# Altium schematic sheet Cabinet_Device.SchDoc
size A4
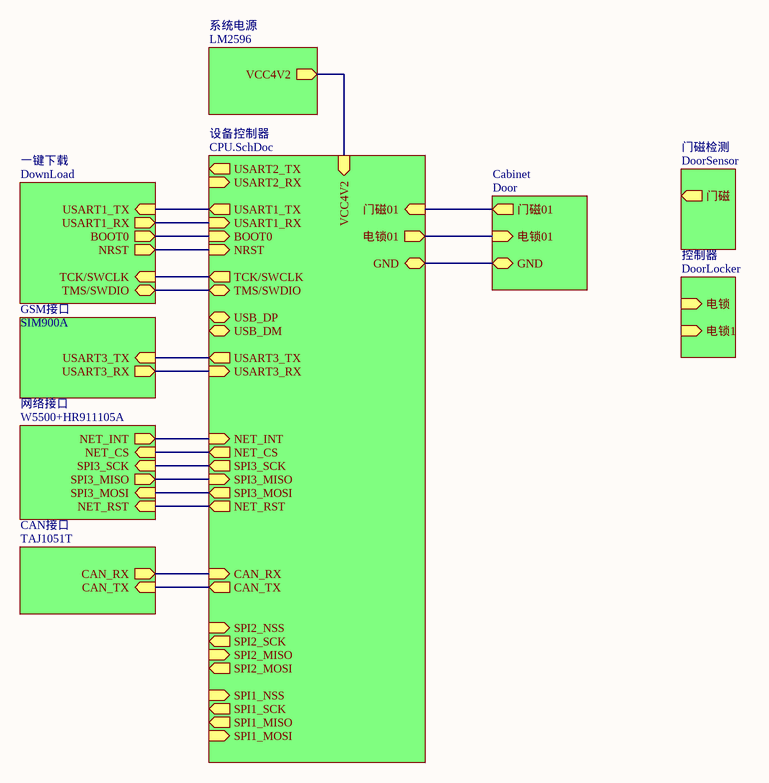
[diagram p0: Cabinet_Device.SchDoc]

## Sub-sheets
Cabinet = Door: 门磁01 (out), 电锁01 (in), GND
CAN接口 = TAJ1051T: CAN_RX (out), CAN_TX (in)
GSM接口 = SIM900A: USART3_RX (out), USART3_TX (in)
一键下载 = DownLoad: BOOT0 (out), NRST (out), USART1_TX (in), USART1_RX (out), TCK/SWCLK (in), TMS/SWDIO (bidir)
控制器 = DoorLocker: 电锁 (in), 电锁1 (in)
系统电源 = LM2596: VCC4V2 (out)
网络接口 = W5500+HR911105A: NET_CS (in), SPI3_MISO (out), SPI3_MOSI (in), SPI3_SCK (in), NET_RST (in), NET_INT (out)
设备控制器 = CPU.SchDoc: CAN_TX (out), CAN_RX (in), USART3_TX (out), USART3_RX (in), USART2_TX (out), USART2_RX (in), SPI1_NSS (in), SPI1_SCK (out), SPI1_MISO (out), SPI1_MOSI (in), USART1_TX (out), USART1_RX (in), 门磁01 (in), NET_CS (out), SPI2_SCK (out), SPI2_MISO (in), SPI2_MOSI (out), NET_RST (out), NET_INT (in), 电锁01 (out), USB_DM, USB_DP, TCK/SWCLK (out), TMS/SWDIO (bidir), VCC4V2 (in), BOOT0 (in), NRST (in), SPI3_SCK (out), SPI3_MISO (in), SPI3_MOSI (out), SPI2_NSS (in), GND
门磁检测 = DoorSensor: 门磁 (out)

## Nets
(unnamed): sheet 设备控制器/CAN_TX, sheet CAN接口/CAN_TX
(unnamed): sheet 设备控制器/CAN_RX, sheet CAN接口/CAN_RX
(unnamed): sheet 设备控制器/USART3_TX, sheet GSM接口/USART3_TX
(unnamed): sheet 设备控制器/USART3_RX, sheet GSM接口/USART3_RX
(unnamed): sheet 设备控制器/USART1_TX, sheet 一键下载/USART1_TX
(unnamed): sheet 设备控制器/USART1_RX, sheet 一键下载/USART1_RX
(unnamed): sheet 设备控制器/门磁01, sheet Cabinet/门磁01
(unnamed): sheet 设备控制器/NET_CS, sheet 网络接口/NET_CS
(unnamed): sheet 设备控制器/NET_RST, sheet 网络接口/NET_RST
(unnamed): sheet 设备控制器/NET_INT, sheet 网络接口/NET_INT
(unnamed): sheet 设备控制器/电锁01, sheet Cabinet/电锁01
(unnamed): sheet 设备控制器/TCK/SWCLK, sheet 一键下载/TCK/SWCLK
(unnamed): sheet 设备控制器/TMS/SWDIO, sheet 一键下载/TMS/SWDIO
(unnamed): sheet 设备控制器/VCC4V2, sheet 系统电源/VCC4V2
(unnamed): sheet 设备控制器/BOOT0, sheet 一键下载/BOOT0
(unnamed): sheet 设备控制器/NRST, sheet 一键下载/NRST
(unnamed): sheet 设备控制器/SPI3_SCK, sheet 网络接口/SPI3_SCK
(unnamed): sheet 设备控制器/SPI3_MISO, sheet 网络接口/SPI3_MISO
(unnamed): sheet 设备控制器/SPI3_MOSI, sheet 网络接口/SPI3_MOSI
(unnamed): sheet 设备控制器/GND, sheet Cabinet/GND